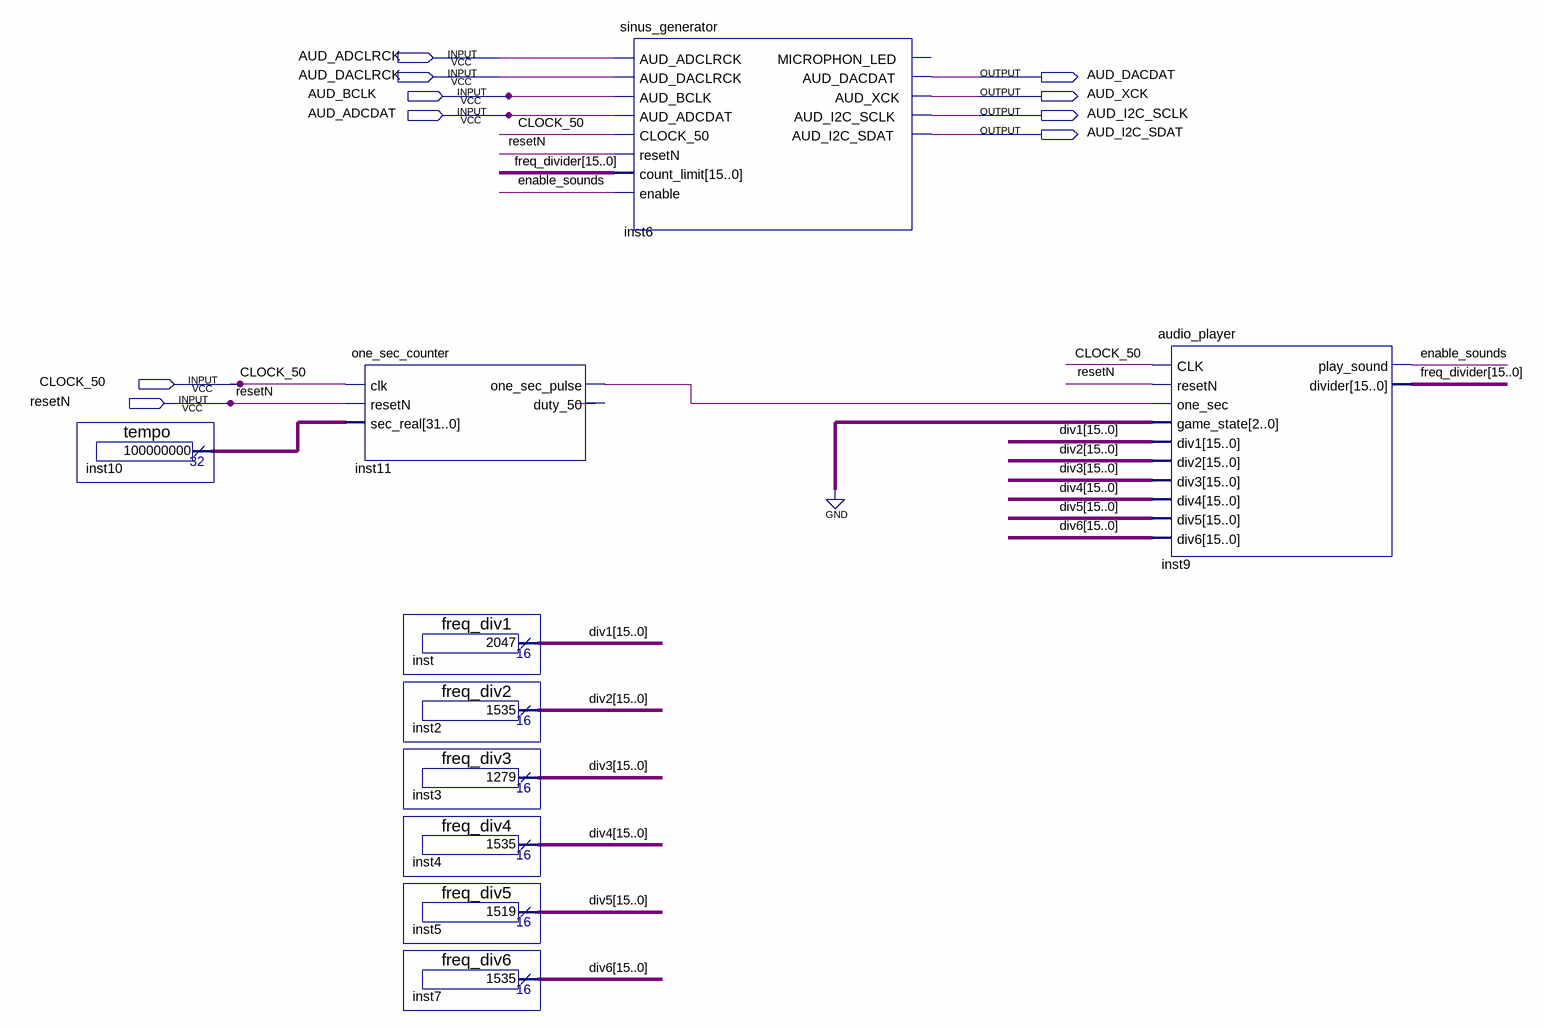
[diagram p0: schematic sheet]
// Quartus schematic tune_player.bdf as structural Verilog: 10 symbols, 10 pins
module tune_player (
  input  AUD_ADCLRCK,
  input  AUD_DACLRCK,
  input  AUD_BCLK,
  input  AUD_ADCDAT,
  input  CLOCK_50,
  input  resetN,
  output AUD_DACDAT,
  output AUD_XCK,
  output AUD_I2C_SCLK,
  output AUD_I2C_SDAT
);

  wire enable_sounds, inst11_one_sec_pulse;
  wire [15:0] div1, div2, div3, div4, div5, div6, freq_divider;
  wire [31:0] inst10_result;

  tempo inst10 (.result(inst10_result));
  one_sec_counter inst11 (
    .clk(CLOCK_50), .resetN(resetN), .sec_real(inst10_result), .one_sec_pulse(inst11_one_sec_pulse));  // open: duty_50
  freq_div1 inst (.result(div1));
  freq_div2 inst2 (.result(div2));
  freq_div3 inst3 (.result(div3));
  freq_div4 inst4 (.result(div4));
  freq_div5 inst5 (.result(div5));
  freq_div6 inst7 (.result(div6));
  sinus_generator inst6 (
    .AUD_ADCLRCK(AUD_ADCLRCK), .AUD_DACLRCK(AUD_DACLRCK), .AUD_BCLK(AUD_BCLK), .AUD_ADCDAT(AUD_ADCDAT),
    .CLOCK_50(CLOCK_50), .resetN(resetN), .count_limit(freq_divider), .enable(enable_sounds),
    .AUD_DACDAT(AUD_DACDAT), .AUD_XCK(AUD_XCK), .AUD_I2C_SCLK(AUD_I2C_SCLK), .AUD_I2C_SDAT(AUD_I2C_SDAT));  // open: MICROPHON_LED
  audio_player inst9 (
    .CLK(CLOCK_50), .resetN(resetN), .one_sec(inst11_one_sec_pulse), .game_state(3'b000), .div1(div1),
    .div2(div2), .div3(div3), .div4(div4), .div5(div5), .div6(div6), .play_sound(enable_sounds),
    .divider(freq_divider));
endmodule
